# EasyEDA Pro project 无人机主控.epro, board PCB_stm32c8t6科创杯
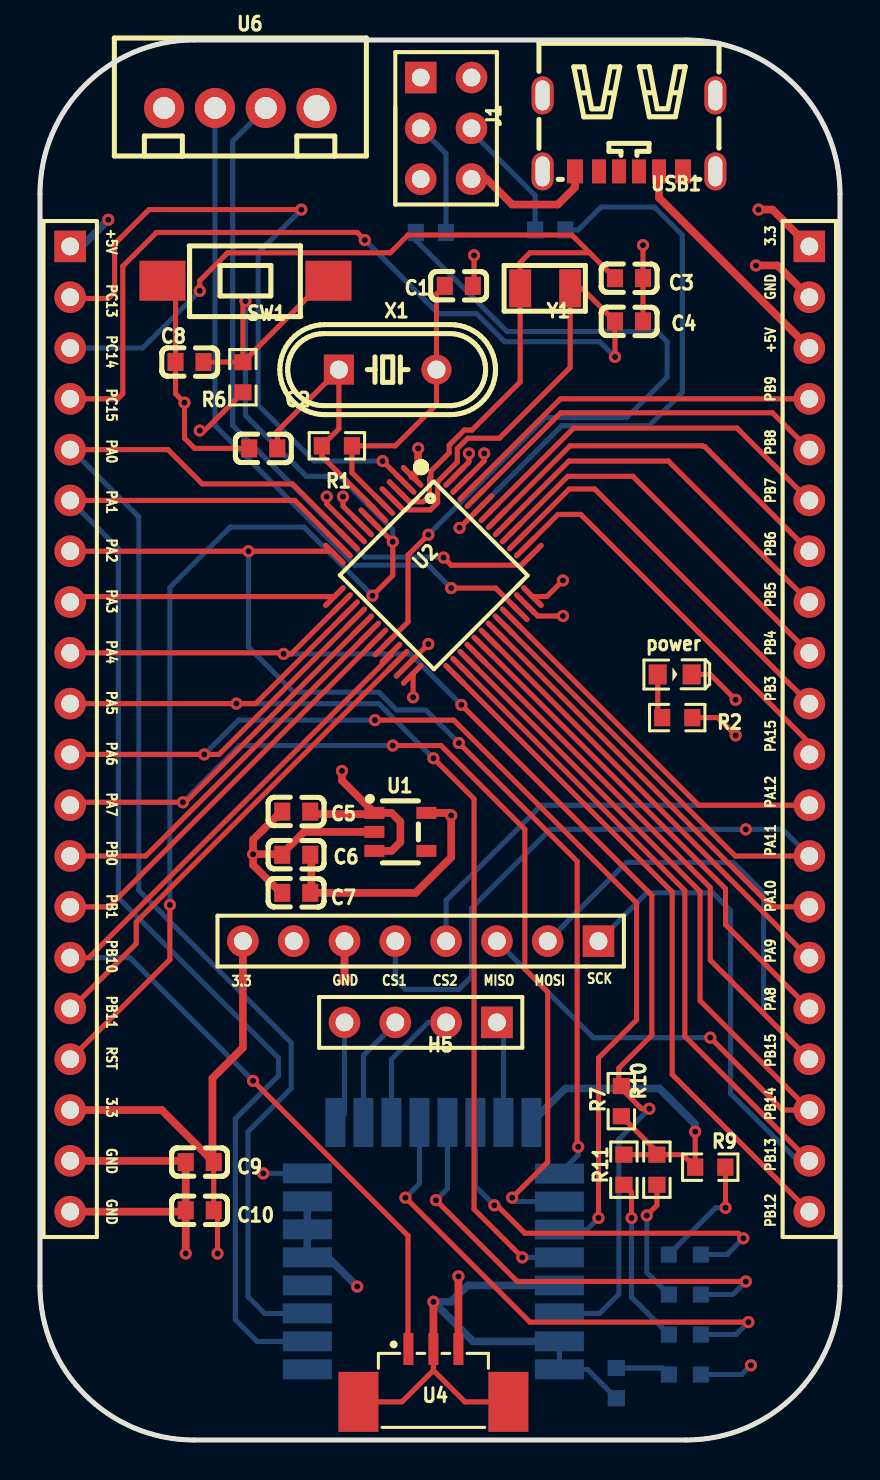
[diagram p5: board, top side]
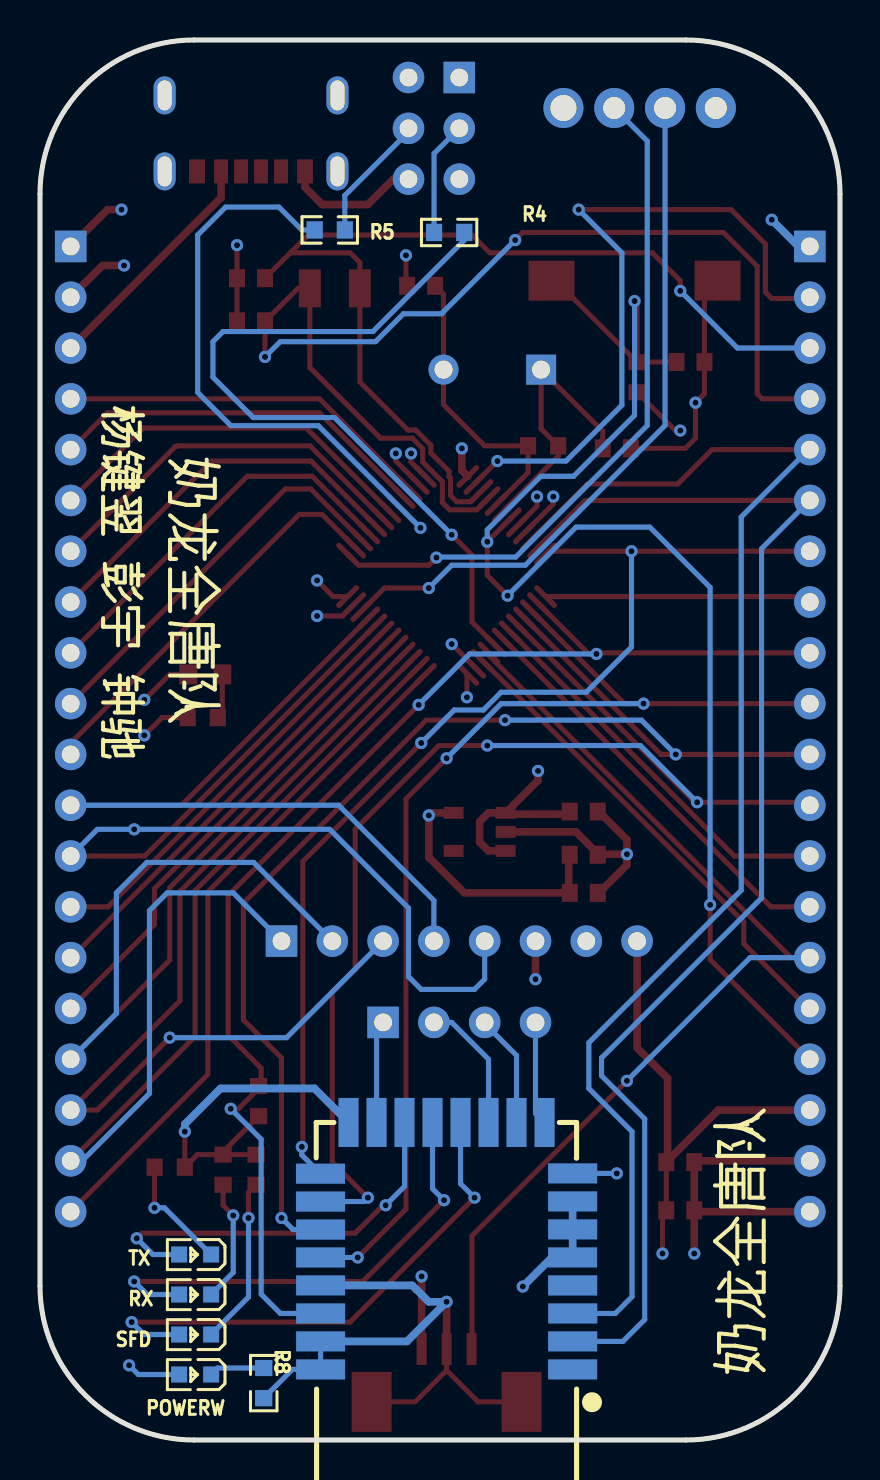
[diagram p6: board, bottom side, seen from below]

Outline 40 x 70 mm; copper layers: Top Layer, 电源层, GND, Bottom Layer. Coordinates in mm from the lower left corner of the outline.
Outline path: 0,62.3 arc(2.26,67.74) 7.7,70 32.3,70 arc(37.74,67.74) 40,62.3 40,7.7 arc(37.74,2.26) 32.3,0 7.7,0 arc(2.26,2.26) 0,7.7 0,62.3
Stack: Top Layer 0.035mm 外层铜厚1oz / Dielectric1 0.2104mm 7628 RC49% 8.6mil / 电源层 0.035mm / Dielectric2 1.065mm 1.1mm H/HOZ Copper / GND 0.035mm / Dielectric3 0.2104mm 7628 RC49% 8.6mil / Bottom Layer 0.035mm 外层铜厚1oz

## Design rules (mm)
spacing Default (default): track to track 0.152, other pairs 0 to 0.152
track width Default (default): min 0.254, default 0.254, max 25.4
differential pair differentialPair (default): width min 0.127, default 0.254, max 2.54; gap min 0.152, default 0.152
via Default (default): diameter min 0.61, default 0.61, max 100.025; hole min 0.305, default 0.305, max 59.995

## Placement (name value [footprint] x y rotation side)
C1  20pF  [C0603]  20.94 57.71 0 top
C2  20pF  [C0603]  11.16 49.58 180 top
C3  20pF  [C0603]  29.45 58.09 180 top
C4  20pF  [C0603]  29.45 55.93 180 top
C5  104  [C0603]  12.81 31.42 0 top
C6  104  [C0603]  12.81 29.26 0 top
C7  104  [C0603]  12.81 27.36 0 top
C8  105  [C0603]  7.48 53.9 180 top
C9  10uF  [C0603]  7.99 13.9 0 top
C10  100nF  [C0603]  7.99 11.48 0 top
H2  HDR-F-2.54_1x20  [HDR-F-2.54_1X20]  1.51 35.55 270 top
H3  HDR-F-2.54_1x20  [HDR-F-2.54_1X20]  38.47 35.55 270 top
H4  IMU  [HDR-F-2.54_1X8]  20.31 24.94 180 top
H5  HDR-F-2.54_1x4  [HDR-F-2.54_1X4]  19.03 20.88 180 top
J1  HDR-M-2.54_2x3  [HDR-M-2.54_2X3]  19.03 68.12 270 top
power  LED-0603_R  [LED0603_RED]  31.74 38.28 0 top
POWERW  INH-S1608BAG20TP-Y3  [LED0603-RD]  32.24 3.28 0 bottom
R1  1M  [R0603]  14.84 49.71 0 top
R2  10k  [R0603]  31.86 36.12 180 top
R4  100k  [R0603]  19.54 60.38 0 bottom
R5  100k  [R0603]  25.51 60.5 180 bottom
R6  10k  [R0603]  10.15 53.14 90 top
R7  10kΩ  [R0603]  29.07 16.94 90 top
R8  10kΩ  [R0603]  28.81 2.85 90 bottom
R9  10kΩ  [R0603]  33.51 13.64 0 top
R10  10kΩ  [R0603]  30.85 13.51 270 top
R11  10kΩ  [R0603]  29.19 13.51 270 top
RX  RXLED  [LED0603-RD]  32.24 7.28 0 bottom
SFD  TXLED  [LED0603-RD]  32.24 5.28 0 bottom
SW1  1TS002B-2500-5000  [SW-SMD_L3.5-W6.0-P8.20]  10.27 57.96 180 top
TX  SFDLED  [LED0603-RD]  32.24 9.28 0 bottom
U1  TPS70933DBVR-TP  [SOT-23-5_L3.0-W1.7-P0.95-LS2.8-BR]  18.02 30.41 180 top
U2  STM32F103C8T6  [LQFP-48_L7.0-W7.0-P0.50-LS9.0-BL]  19.67 43.23 225 top
U3  DWM1000  [WIRELM-TH_DWM1000]  19.67 9.7 0 bottom
U4  power  [CONN-SMD_3P-P1.25-MX1.25-LT-3]  19.67 3.23 0 top
U6  XH2.54-4PIN  [CONN-TH_XH2.54-4]  10.02 66.6 0 top
USB1  TYPE-C 6P  [TYPE-C-SMD_TYPE-C-6P]  29.45 65.33 180 top
X1  8MHz  [HC-49US_L11.5-W4.5-P4.88]  17.38 53.52 0 top
Y1  32.768kHz  [SMD3215]  25.26 57.58 180 top

## Footprints (pads in the part's own frame, mm; a bottom-side part is the same pattern mirrored in y, then rotated)
C0603
  rect 0.8x0.9 smd: 1(-0.7,0) 2(0.7,0)
CONN-SMD_3P-P1.25-MX1.25-LT-3
  rect 0.5x1.6 smd: 1(-1.25,1.321) 2(0.001,1.321) 3(1.25,1.321)
  rect 2x3 smd: 4(3.748,-1.321) 5(-3.748,-1.321)
CONN-TH_XH2.54-4
  round 2 hole 1.1: 1(-3.81,0) 2(-1.27,0) 3(1.27,0)
  round 2 hole 1.3: 4(3.81,0)
HC-49US_L11.5-W4.5-P4.88
  rect 1.5x1.5 hole 0.9: 1(-2.44,0)
  round 1.5 hole 0.9: 2(2.44,0)
HDR-F-2.54_1X4
  rect 1.575x1.575 hole 0.889: 1(-3.81,0)
  round 1.575 hole 0.889: 2(-1.27,0) 3(1.27,0) 4(3.81,0)
HDR-F-2.54_1X8
  rect 1.575x1.575 hole 0.889: 1(-7.62,0)
  round 1.575 hole 0.889: 2(-5.08,0) 3(-2.54,0) 4(0,0) 5(2.54,0) 6(5.08,0) 7(7.62,0) 8(10.16,0)
HDR-F-2.54_1X20
  rect 1.575x1.575 hole 0.889: 1(-24.13,0)
  round 1.575 hole 0.889: 2(-21.59,0) 3(-19.05,0) 4(-16.51,0) 5(-13.97,0) 6(-11.43,0) 7(-8.89,0) 8(-6.35,0) 9(-3.81,0) 10(-1.27,0) 11(1.27,0) 12(3.81,0) 13(6.35,0) 14(8.89,0) 15(11.43,0) 16(13.97,0) 17(16.51,0) 18(19.05,0) 19(21.59,0) 20(24.13,0)
HDR-M-2.54_2X3
  rect 1.575x1.575 hole 0.889: 1(0,0)
  round 1.575 hole 0.889: 2(0,2.54) 3(2.54,0) 4(2.54,2.54) 5(5.08,0) 6(5.08,2.54)
LED0603-RD
  rect 0.8x0.8 smd: 1(-0.799,0) 2(0.799,0)
LED0603_RED
  rect 0.9x1 smd: 1(-0.85,0) 2(0.85,0)
LQFP-48_L7.0-W7.0-P0.50-LS9.0-BL
  oval 0.27x1.5 smd: 1(-2.75,-4.25) 2(-2.25,-4.25) 3(-1.75,-4.25) 4(-1.25,-4.25) 5(-0.75,-4.25) 6(-0.25,-4.25) 7(0.25,-4.25) 8(0.75,-4.25) 9(1.25,-4.25) 10(1.75,-4.25) 11(2.25,-4.25) 12(2.75,-4.25) 25(2.75,4.25) 26(2.25,4.25) 27(1.75,4.25) 28(1.25,4.25) 29(0.75,4.25) 30(0.25,4.25) 31(-0.25,4.25) 32(-0.75,4.25) 33(-1.25,4.25) 34(-1.75,4.25) 35(-2.25,4.25) 36(-2.75,4.25)
  oval 1.5x0.27 smd: 13(4.25,-2.75) 14(4.25,-2.25) 15(4.25,-1.75) 16(4.25,-1.25) 17(4.25,-0.75) 18(4.25,-0.25) 19(4.25,0.25) 20(4.25,0.75) 21(4.25,1.25) 22(4.25,1.75) 23(4.25,2.25) 24(4.25,2.75) 37(-4.25,2.75) 38(-4.25,2.25) 39(-4.25,1.75) 40(-4.25,1.25) 41(-4.25,0.75) 42(-4.25,0.25) 43(-4.25,-0.25) 44(-4.25,-0.75) 45(-4.25,-1.25) 46(-4.25,-1.75) 47(-4.25,-2.25) 48(-4.25,-2.75)
R0603
  rect 0.806x0.864 smd: 1(-0.753,0) 2(0.753,0)
SMD3215
  rect 1.1x1.9 smd: 1(-1.25,0) 2(1.25,0)
SOT-23-5_L3.0-W1.7-P0.95-LS2.8-BR
  rect 1x0.6 smd: 1(1.3,-0.95) 2(1.3,0) 3(1.3,0.95) 4(-1.3,0.95) 5(-1.3,-0.95)
SW-SMD_L3.5-W6.0-P8.20
  rect 2.3x2 smd: A(-4.15,0) B(4.15,0)
TYPE-C-SMD_TYPE-C-6P
  oval 1.1x1.9 hole 0.7x1.5: 7(-4.32,1.9) 7(-4.32,-1.9) 7(4.32,1.9) 7(4.32,-1.9)
  rect 0.7x1.2 smd: A5(-0.5,1.9) A9(1.5,1.9) B5(0.5,1.9) B9(-1.5,1.9)
  rect 0.8x1.2 smd: A12(2.7,1.9) B12(-2.7,1.9)
WIRELM-TH_DWM1000
  rect 2.45x1 smd: 1(-6.301,6.175) 2(-6.303,4.776) 3(-6.304,3.376) 4(-6.303,1.976) 5(-6.3,0.574) 6(-6.303,-0.827) 7(-6.301,-2.224) 8(-6.303,-3.626) 17(6.304,-3.613) 18(6.301,-2.218) 19(6.3,-0.818) 20(6.301,0.576) 21(6.3,1.974) 22(6.298,3.374) 23(6.301,4.774) 24(6.301,6.175)
  rect 1x2.45 smd: 9(-4.901,-6.17) 10(-3.497,-6.173) 11(-2.097,-6.175) 12(-0.697,-6.175) 13(0.703,-6.175) 14(2.103,-6.175) 15(3.503,-6.175) 16(4.903,-6.173)

## Nets
As in the schematic, except:
GND: C1.2 C2.2 C3.1 C4.1 C5.1 C6.1 C7.1 C8.2 C9.1 C10.1 H2.19 H2.20 H3.2 H4.6 J1.5 J1.6 power.2 R7.1 R8.1 R9.1 R10.1 R11.1 SW1.B U1.2 U2.8 U2.23 U2.35 U2.47 U3.8 U3.16 U3.21 U3.23 U3.24 U4.2 U4.4 U4.5 U6.4 USB1.A12
GPIO1: TX.2 U3.14
GPIO2: RX.2 U3.13
GPIO3: SFD.2 U3.12
$1N82: power.1 R2.2
$1N1127: R9.2 TX.1
$1N1128: R10.2 RX.1
$1N1129: R11.2 SFD.1

Pads without a net: H4 7; U1 4; U3 1 4; USB1 7 A5 A9 B5 B12

## Via types
v1: diameter 0.61, hole 0.305, Top Layer to Bottom Layer, 70 vias

## Routing (per net, layer and track width the routed paths; a pad name or vN(x,y) marks a point on that pad's centre or on a via; arc(x,y) is an arc through that point)
+3.3V: length 69.5
  Top Layer w0.254: 8.62,13.96 C9.2 C10.2 8.88,11.29 v1(8.88,9.32) ; R2.1 33.89,36.12 v1(34.78,35.23) ; v1(18.65,37.14) 18.65,38.24 U2.24 ; v1(7.99,50.47) 8.23,50.47 R6.1 ; v1(26.15,42.98) 25.34,42.17 U2.36 ; U2.9 14.34,46.8 v1(14.34,47.17) ; v1(21.45,49.33) 21.45,48.9 U2.48
  Top Layer w0.381: H4.8 10.15,19.61 8.62,18.09 8.62,13.96 6.08,16.5 H2.18 ; 13.57,29.26 13.57,27.36 18.78,27.36 20.56,29.14 v1(20.56,31.23) 20.43,31.36 U1.5 ; v1(35.93,61.52) 36.62,61.52 H3.1
  电源层 w0.254: v1(15.86,7.67) 10.53,7.67 v1(8.88,9.32)
  Bottom Layer w0.254: v1(35.54,3.74) 35.09,3.28 POWERW.2
  Bottom Layer w0.381: U3.7 13.37,10.53 U3.6 13.37,9.13 U3.5 14.4,9.13 v1(15.86,7.67)
+5V: length 124.5
  Top Layer w0.381: 13.57,31.42 13.69,31.29 16.66,31.29 U1.1 ; U1.1 15.1,32.98 v1(15.1,33.45) ; U1.1 17.58,31.36 18.02,30.91 18.02,29.9 17.58,29.45 U1.3 ; U2.1 18.91,48.48 v1(18.91,49.58) ; H3.3 30.95,62.12 USB1.B9 ; U4.3 v1(20.92,8.18)
  电源层 w0.381: H3.3 33.96,50.09 19.42,50.09 v1(18.91,49.58) 15.1,45.77 ; v1(3.41,61.01) 3.41,50.34 7.99,45.77 15.1,45.77 ; v1(20.92,8.18) 19.3,9.8 14.36,9.8 14.09,10.07 14.09,25.41 15.1,26.42 v1(15.1,33.45) 15.1,45.77
  Bottom Layer w0.381: v1(3.41,61.01) 2.08,59.68 H2.1
GND: length 118.8
  Top Layer w0.254: 19.67,3.48 18.09,1.91 U4.5 ; 19.67,3.48 21.25,1.91 U4.4 ; 19.67,3.48 U4.2 ; R7.1 30.85,14.41 ; 19.42,39.8 v1(19.42,39.8) U2.23 ; v1(32.76,15.42) R9.1 32.13,14.27 R10.1 R11.1 ; power.2 33.51,38.28 v1(34.78,37.01) ; v1(30.15,59.74) C3.1 C4.1 ; v1(21.7,59.23) 21.7,57.77 C1.2 ; v1(26.15,41.2) 24.88,41.2 U2.35 ; v1(22.21,49.33) 22.21,48.95 U2.47 ; U2.8 15.15,46.69 v1(15.15,47.17) ; C2.2 7.73,49.58 7.22,50.09 v1(7.22,51.87) 6.78,52.31 C8.2 6.78,57.31 SW1.B
  Top Layer w0.381: v1(10.65,29.29) 10.65,28.75 12.05,27.36 12.06,27.36 ; v1(10.65,29.29) 10.65,30.02 12.06,31.42 ; v1(10.65,29.29) 12.03,29.29 ; 12.06,29.26 13.2,30.41 U1.2 ; C10.1 7.22,11.42 H2.20 ; C10.1 v1(7.29,9.32) ; C10.1 C9.1 7.22,13.96 H2.19 ; H4.6 v1(15.22,23.04) ; J1.6 22.34,63.04 23.61,61.77 25.89,61.77 26.75,62.63 26.75,63.43 ; U4.2 v1(19.67,6.91) ; H3.2 36.88,58.73 v1(35.8,58.73) ; 30.85,14.41 R10.1
  Bottom Layer w0.254: R8.1 27.38,3.53 U3.24 U3.23 ; U3.8 v1(11.16,13.33)
  Bottom Layer w0.381: U3.21 21.39,7.73 21.19,7.53 21.18,7.53 20.56,6.91 v1(19.67,6.91) 21.65,4.93 U3.23 ; U3.16 26.27,17.58 30.97,17.58 32.75,15.8 32.75,15.43 v1(32.76,15.42)
BOOT0: length 30.4
  Top Layer w0.254: U2.44 20.99,45.61 v1(20.98,45.61)
  Bottom Layer w0.254: v1(20.98,45.61) 26.09,50.72 30.46,50.72 32.12,52.38 32.12,60.25 30.72,61.65 28.05,61.65 26.91,60.5 R5.1
BOOT1: length 38.5
  Top Layer w0.254: U2.20 18.4,40.9 18.4,44.25 v1(19.42,45.26)
  Bottom Layer w0.254: v1(19.42,45.26) 25.28,51.12 29.34,51.12 31.35,53.14 31.35,54.92 30.85,55.42 23.35,55.42 18.79,59.99 R4.1
GPIO1: length 20.1
  Top Layer w0.254: v1(35.16,10.09) 34.91,10.34 24.24,10.34 22.84,11.74 v1(22.72,11.74)
  Bottom Layer w0.254: U3.14 21.77,12.68 v1(22.72,11.74) ; TX.2 34.35,9.28 v1(35.16,10.09)
GPIO2: length 23.8
  Top Layer w0.254: v1(19.8,11.99) 23.86,7.93 v1(35.29,7.93)
  Bottom Layer w0.254: v1(35.29,7.93) 34.64,7.28 RX.2 ; U3.13 20.37,12.57 v1(19.8,11.99)
GPIO3: length 26.4
  Top Layer w0.254: v1(35.42,5.89) 24.5,5.89 v1(18.27,12.12)
  Bottom Layer w0.254: v1(18.27,12.12) 18.97,12.82 U3.12 ; v1(35.42,5.89) 34.8,5.28 SFD.2
OSC1: length 14.8
  Top Layer w0.254: C1.1 19.82,57.29 X1.2 19.82,51.77 17.76,49.71 R1.2 15.6,48.37 U2.5
OSC2: length 13.7
  Top Layer w0.254: 16.79,46.49 14.09,49.19 R1.1 14.94,50.56 X1.1 11.86,50.44 C2.1
PA0: length 67
  Top Layer w0.254: H2.5 6.4,49.52 8.11,47.8 12.62,47.8 U2.10
  Bottom Layer w0.254: H2.5 1.57,49.52 4.94,46.15 4.94,27.48 12.56,19.86 12.56,17.58 10.4,15.42 10.4,7.16 11.24,6.33 U3.3
PA1: length 64.8
  Top Layer w0.254: H2.6 12.74,46.98 U2.11
  Bottom Layer w0.254: H2.6 3.92,44.57 3.92,27.1 11.92,19.1 11.92,18.21 9.76,16.05 9.76,6.02 10.86,4.93 U3.2
PA2: length 55
  Top Layer w0.254: v1(20.94,34.85) 26.86,28.93 26.86,14.71 v1(26.91,14.66) ; H2.7 v1(10.43,44.44) 14.57,44.44 U2.12
  Bottom Layer w0.254: v1(10.43,44.44) 10.43,39.65 12.69,37.39 16.94,37.39 17.83,36.5 19.29,36.5 v1(20.94,34.85) ; v1(26.91,14.66) 26.91,14.25 U3.17
PA3: length 13.3
  Top Layer w0.254: H2.8 1.78,42.17 U2.13
PA4: length 63.5
  Top Layer w0.254: H2.9 12.12,39.36 v1(12.18,39.3) 12.56,39.3 U2.14 ; v1(21.07,36.75) 30.59,27.23 30.59,20.25 28.94,18.59 28.94,17.7 30.08,16.56 v1(30.47,16.56)
  Bottom Layer w0.254: U3.22 27.98,6.33 28.94,7.29 28.94,15.04 v1(30.47,16.56) ; v1(12.18,39.3) 18.52,39.3 v1(21.07,36.75)
PA5: length 55.5
  Top Layer w0.254: U2.15 10.78,36.82 v1(9.82,36.82) H2.10 ; v1(19.67,34.09) 21.7,32.06 21.7,11.54 v1(24.12,9.13)
  Bottom Layer w0.254: v1(9.82,36.82) 16.94,36.82 v1(19.67,34.09) ; U3.20 v1(24.12,9.13)
PA6: length 61.9
  Top Layer w0.254: v1(27.93,11.1) 27.93,19.1 29.83,21.01 29.83,26.85 20.69,35.99 v1(16.75,35.99) ; U2.16 8.95,34.28 v1(8.21,34.28) H2.11
  Bottom Layer w0.254: v1(16.75,35.99) 9.93,35.99 v1(8.21,34.28) ; v1(27.93,11.1) 27.35,10.52 U3.19
PA7: length 60.4
  Top Layer w0.254: v1(17.64,34.72) 20.05,34.72 24.24,30.53 24.24,23.55 25.38,22.4 25.38,13.9 v1(23.61,12.12) ; U2.17 7.26,31.89 v1(7.15,31.89) 1.66,31.89 H2.12
  Bottom Layer w0.254: v1(17.64,34.72) 9.98,34.72 v1(7.15,31.89) ; v1(23.61,12.12) 23.8,11.92 25.97,11.92
PA8: length 24.9
  Top Layer w0.254: H3.16 34.28,25.77 34.28,27.57 U2.29
PA9: length 22.6
  Top Layer w0.254: U2.30 38.43,24.12 H3.15
PA10: length 21.3
  Top Layer w0.254: U2.31 36.6,26.66 H3.14
PA11: length 48.7
  Top Layer w0.254: H3.13 34.76,29.2 U2.32
  Bottom Layer w0.254: H3.13 37.13,30.53 v1(35.29,30.53) 25.51,30.53 21.57,26.59 21.57,23.17 20.94,22.53 18.27,22.53 17.76,23.04 17.76,24.94
PA12: length 41
  Top Layer w0.254: U2.33 32.93,31.74 H3.12
  Bottom Layer w0.254: H3.12 25.07,31.74 20.31,26.98 H4.4
PA13: length 34.9
  Top Layer w0.254: v1(20.56,42.6) 22.78,42.6 U2.34
  Bottom Layer w0.254: U6.2 8.75,50.72 15.73,43.74 19.42,43.74 v1(20.56,42.6)
PA14: length 34.7
  Top Layer w0.254: v1(20.18,44.12) 20.56,43.74 24.07,43.74 U2.37
  Bottom Layer w0.254: v1(20.18,44.12) 20.15,44.15 16.22,44.15 9.64,50.72 9.64,64.95 U6.3
PA15: length 20.2
  Top Layer w0.254: U2.38 25.9,46.28 27.04,46.28 38.47,34.85 H3.11
PB0: length 19.6
  Top Layer w0.254: H2.13 5.28,29.2 U2.18
PB1: length 20.9
  Top Layer w0.254: H2.14 3.45,26.66 U2.19
PB3: length 20.1
  Top Layer w0.254: U2.39 26.46,47.55 27.73,47.55 H3.10
PB4: length 19.7
  Top Layer w0.254: H3.9 29.64,48.19 26.39,48.19 U2.40
PB5: length 19.5
  Top Layer w0.254: H3.8 31.42,48.95 26.45,48.95 U2.41
PB6: length 19.3
  Top Layer w0.254: H3.7 33.23,49.67 33.16,49.67 33.13,49.71 26.5,49.71 U2.42
PB7: length 19.2
  Top Layer w0.254: H3.6 34.85,50.6 26.68,50.6 U2.43
PB8: length 19.2
  Top Layer w0.254: H3.5 36.62,51.36 26.03,51.36 21.79,47.12
PB9: length 18.9
  Top Layer w0.254: U2.46 26.02,52.06 H3.4
PB10: length 50.7
  Top Layer w0.254: H2.15 2.45,24.12 17.55,39.22 17.55,39.34 ; v1(10.65,17.96) 18.4,10.21 18.4,4.57 U4.1
  Bottom Layer w0.254: v1(10.65,17.96) 4.49,24.12 H2.15
PB11: length 24.2
  Top Layer w0.254: U2.22 4.81,25.9 4.81,24.82 1.57,21.58 H2.16
PB12: length 34.2
  Top Layer w0.254: U2.25 31.61,27.41 31.61,18.28 H3.20
PB13: length 54.3
  Top Layer w0.254: H3.19 32.24,20.18 32.24,27.48 U2.26
  Bottom Layer w0.254: H3.19 37.89,13.96 34.53,17.32 34.53,26.47 33.64,27.36 30.34,27.36 H4.1
PB14: length 48.7
  Top Layer w0.254: U2.27 33,27.42 33,21.96 H3.18 37.13,16.5 v1(33.51,20.12)
  Bottom Layer w0.254: H4.3 27.67,20.12 v1(33.51,20.12)
PB15: length 49.5
  Top Layer w0.254: H3.17 33.51,23.99 33.51,27.62 21.79,39.34
  Bottom Layer w0.254: 25.38,24.94 29.32,28.88 34.66,28.88 36.18,27.36 36.18,21.32 H3.17
PC13: length 34.5
  Top Layer w0.254: v1(17.13,48.95) 17.14,48.95 U2.2 ; H2.2 1.57,57.08 3.41,57.08 3.73,57.39 3.73,59.81 5.45,61.52 v1(13.07,61.52)
  Bottom Layer w0.254: v1(13.07,61.52) 10.91,59.36 10.91,51.74 13.7,48.95 v1(17.13,48.95)
PC14: length 50.1
  Top Layer w0.254: 27.48,59.36 24.5,59.36 24.01,58.87 Y1.2 24.01,52.9 21.6,50.5 21.22,50.5 20.46,49.74 20.46,49.35 19.54,48.44 19.54,48.16 19.47,48.09 19.47,47.23 19.16,46.92 18.46,46.92 U2.3 ; 27.48,59.36 28.75,58.09 ; 27.48,59.36 26.59,60.25 18.4,60.25 17.51,59.36 9.38,59.36 7.99,57.96 v1(7.99,57.46)
  Bottom Layer w0.254: v1(7.99,57.46) 5.13,54.6 H2.3
PC15: length 58.8
  Top Layer w0.254: v1(28.75,54.15) 28.75,55.93 27.1,57.58 Y1.1 26.51,53.63 22.97,50.09 21.38,50.09 20.86,49.57 20.86,48.9 19.88,47.92 19.88,46.87 19.52,46.51 18.16,46.51 17.55,47.12 ; H2.4 3.88,52.06 4.14,52.31 4.14,58.69 5.83,60.38 15.86,60.38 v1(16.24,60)
  Bottom Layer w0.254: v1(28.75,54.15) 27.99,54.92 23.23,54.92 21.83,56.31 19.92,56.31 v1(16.24,60)
RST: length 70.3
  Top Layer w0.254: v1(6.49,26.75) 6.49,24.02 H2.17 ; v1(10.27,56.95) 10.15,56.82 R6.2 ; C8.1 10.14,53.9 R6.2 ; SW1.A 14.22,57.96 R6.2 ; v1(16.62,42.22) 17.64,43.23 v1(17.64,44.91) U2.7
  Bottom Layer w0.254: v1(6.49,26.75) 6.49,42.63 9.51,45.64 13.19,45.64 v1(16.62,42.22) ; v1(17.64,44.91) 17.64,45.51 14.96,48.19 13.32,48.19 10.27,51.23 v1(10.27,56.95)
$1N8: length 6.4
  Bottom Layer w0.254: J1.4 21.57,65.41 24.76,62.23 R5.2
$1N11: length 5.7
  Bottom Layer w0.254: R4.2 20.3,64.32 J1.3
$1N82: length 2.3
  Top Layer w0.254: 30.88,38.28 30.88,36.34 R2.2
$1N97: length 5.2
  Bottom Layer w0.254: U3.9 15.22,16.33 H5.4
$1N98: length 5.7
  Bottom Layer w0.254: U3.10 16.17,19.23 17.76,20.82 H5.3
$1N99: length 6.7
  Bottom Layer w0.254: H5.2 19.42,20.88 17.57,19.04 U3.11
$1N100: length 5.1
  Bottom Layer w0.254: H5.1 23.17,20.55 U3.15
$1N1126: length 2.8
  Bottom Layer w0.254: POWERW.1 31.12,3.6 R8.2
$1N1127: length 5.8
  Top Layer w0.254: R9.2 34.28,13.63 v1(34.28,11.61)
  Bottom Layer w0.254: v1(34.28,11.61) 33.78,11.61 TX.1
$1N1128: length 6.2
  Top Layer w0.254: R10.2 30.85,11.74 v1(30.34,11.23)
  Bottom Layer w0.254: RX.1 30.34,8.38 v1(30.34,11.23)
$1N1129: length 8.4
  Top Layer w0.254: R11.2 29.58,12.38 v1(29.58,11.1)
  Bottom Layer w0.254: v1(29.58,11.1) 29.58,7.14 SFD.1

## Copper pours and planes (outline as drawn; the poured copper is in the pictures)
+3.3V on 电源层: 0.87,70.28 41.26,70.28 41.26,-0.07 0.87,-0.07
GND on GND: -0.27,70.28 41.13,70.28 41.13,-0.71 -0.27,-0.71

## Text on the board
Bottom Silkscreen Layer: 杨键翌 彭宇 钟驰 | 奶龙全唐队
Top Silkscreen Layer: 3.3 | GND | +5V | PB9 | PB8 | PB7 | PB6 | PB5 | PB4 | PB3 | PA15 | PA12 | PA11 | PA10 | PA9 | PA8 | PB15 | PB14 | PB13 | PB12 | PC13 | PC14 | PC15 | PA0 | PA1 | PA2 | PA3 | PA4 | PA5 | PA6 | PA7 | PB0 | PB1 | PB10 | PB11 | RST | CS1 | CS2 | MISO | MOSI | SCK
